# EAGLE design Stoicheia (EAGLE 9.6.2)
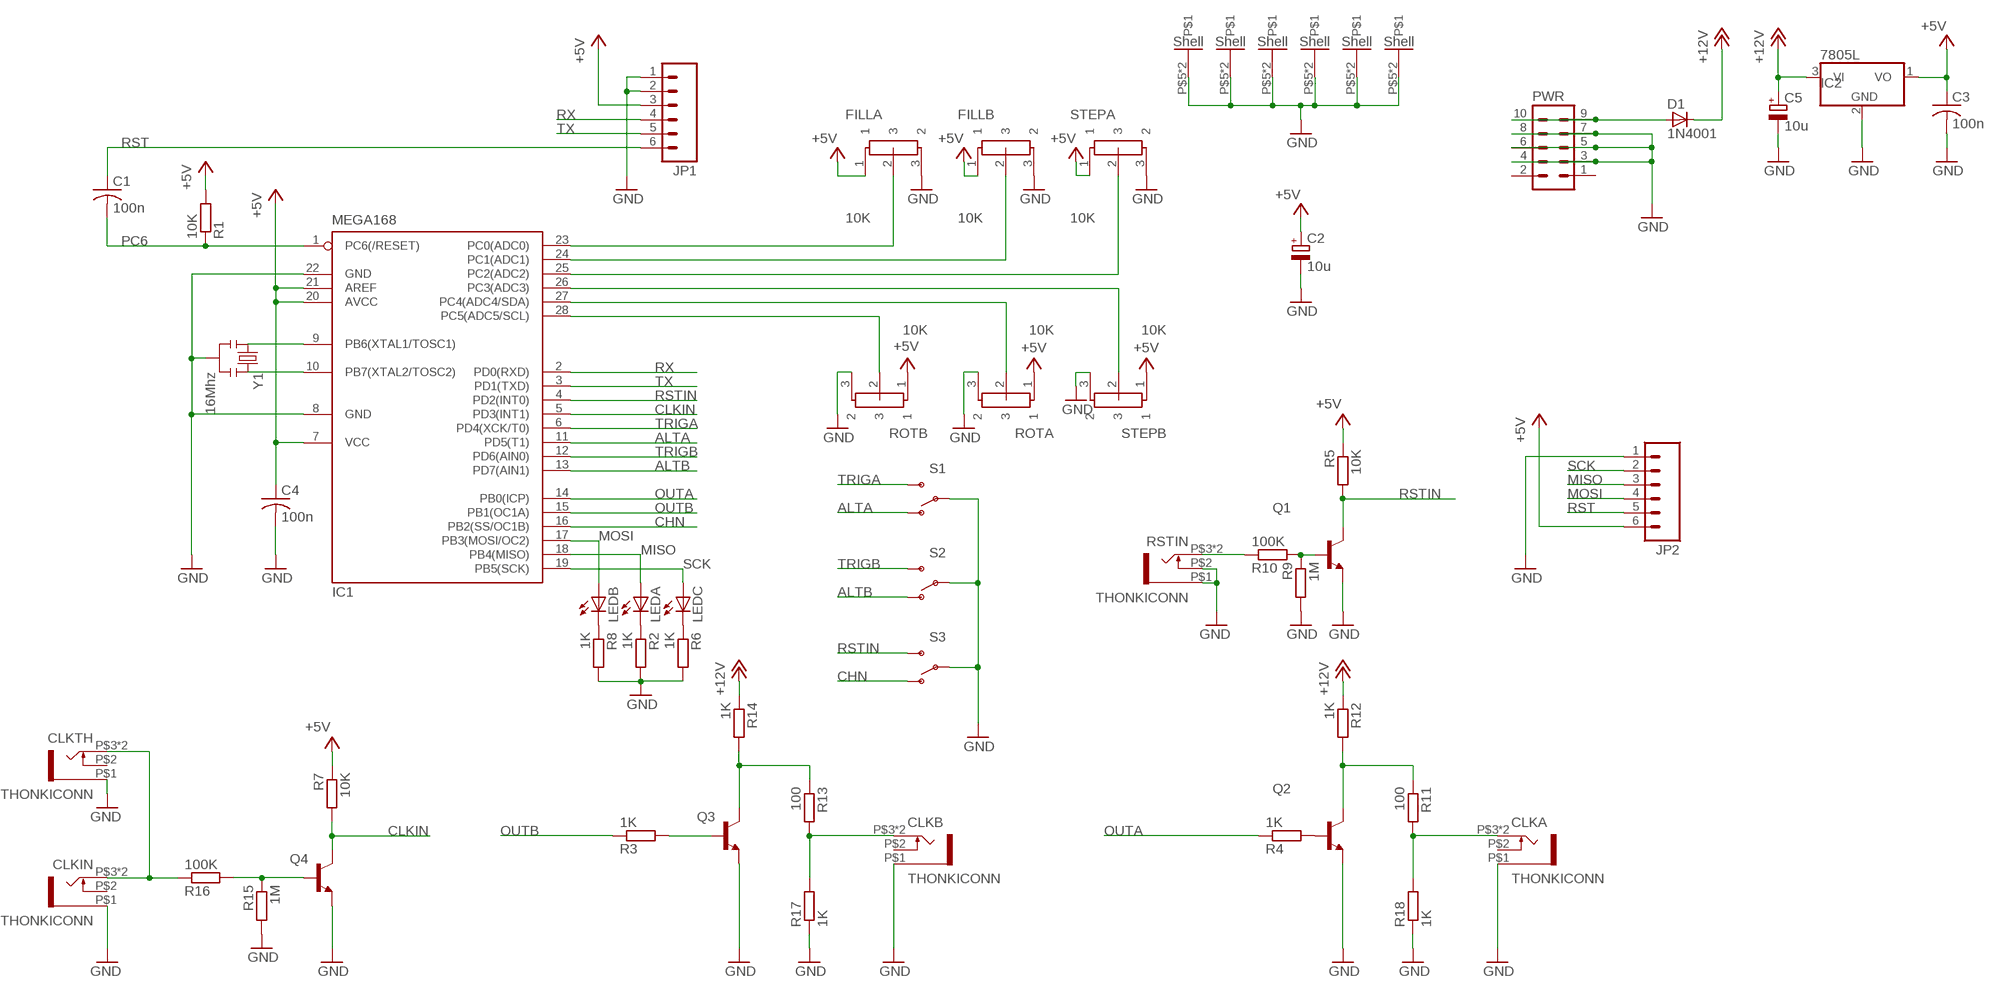
[diagram p0: schematic, sheet 1]

## Parts
C1  100n  C-US050-024X044  [C050-024X044]
C2  10u  CPOL-EUE5-6  [E5-6]
C3  100n  C-US050-024X044  [C050-024X044]
C4  100n  C-US050-024X044  [C050-024X044]
C5  10u  CPOL-EUE5-6  [E5-6]
CLKA  THONKICONN  [THONKICONN]
CLKB  THONKICONN  [THONKICONN]
CLKIN  THONKICONN  [THONKICONN]
CLKTH  THONKICONN  [THONKICONN]
D1  1N4001  DIODE1N4001  [DIODE-1N4001]
FILLA  10K  POT-ALPS_ALPS290024  [POT-ALPS-RK09L1140]
FILLB  10K  POT-ALPS_ALPS290024  [POT-ALPS-RK09L1140]
IC1  MEGA168  MEGA8-P  [DIL28-3]
IC2  7805L  [TO92]
JP1  M06SIP  [1X06]
JP2  M06SIP  [1X06]
LEDA  LED3MM  [LED3MM]
LEDB  LED3MM  [LED3MM]
LEDC  LED3MM  [LED3MM]
PWR  MA05-2  [MA05-2]
Q1  2N3904-NPN-TO92-EBC  [TO92-EBC]
Q2  2N3904-NPN-TO92-EBC  [TO92-EBC]
Q3  2N3904-NPN-TO92-EBC  [TO92-EBC]
Q4  2N3904-NPN-TO92-EBC  [TO92-EBC]
R1  10K  R-EU_0204/7  [0204/7]
R2  1K  R-EU_0204/7  [0204/7]
R3  1K  R-EU_0204/7  [0204/7]
R4  1K  R-EU_0204/7  [0204/7]
R5  10K  R-EU_0204/7  [0204/7]
R6  1K  R-EU_0204/7  [0204/7]
R7  10K  R-EU_0204/7  [0204/7]
R8  1K  R-EU_0204/7  [0204/7]
R9  1M  R-EU_0204/7  [0204/7]
R10  100K  R-EU_0204/7  [0204/7]
R11  100  R-EU_0204/7  [0204/7]
R12  1K  R-EU_0204/7  [0204/7]
R13  100  R-EU_0204/7  [0204/7]
R14  1K  R-EU_0204/7  [0204/7]
R15  1M  R-EU_0204/7  [0204/7]
R16  100K  R-EU_0204/7  [0204/7]
R17  1K  R-EU_0204/7  [0204/7]
R18  1K  R-EU_0204/7  [0204/7]
ROTA  10K  POT-ALPS_ALPS290024  [POT-ALPS-RK09L1140]
ROTB  10K  POT-ALPS_ALPS290024  [POT-ALPS-RK09L1140]
RSTIN  THONKICONN  [THONKICONN]
S1  SWITCH-SPST  [SWITCH-SPDT-SALECOM-T8014]
S2  SWITCH-SPST  [SWITCH-SPDT-SALECOM-T8014]
S3  SWITCH-SPST  [SWITCH-SPDT-SALECOM-T8014]
STEPA  10K  POT-ALPS_ALPS290024  [POT-ALPS-RK09L1140]
STEPB  10K  POT-ALPS_ALPS290024  [POT-ALPS-RK09L1140]
Y1  16Mhz  RESONATORPTH  [RESONATOR-PTH]

## Nets
+5V: C2.+ C3.1 C4.1 FILLA.1 FILLB.1 IC1.7(VCC) IC1.20(AVCC) IC1.21(AREF) IC2.1(VO) JP1.3 JP2.6 R1.2 R5.1 R7.1 ROTA.1 ROTB.1 STEPA.1 STEPB.1
+12V: C5.+ D1.C IC2.3(VI) R12.1 R14.1
ALTA: IC1.11(PD5(T1)) S1.1(O)
ALTB: IC1.13(PD7(AIN1)) S2.1(O)
CHN: IC1.16(PB2(SS/OC1B)) S3.1(O)
CLKIN: IC1.5(PD3(INT1)) Q4.C R7.2
FILFB: FILLB.2 IC1.24(PC1(ADC1))
GND: C2.- C3.2 C4.2 C5.- CLKA.P$1 CLKB.P$1 CLKIN.P$1 CLKTH.P$1 FILLA.3 FILLA.P$5 FILLA.P$6 FILLB.3 FILLB.P$5 FILLB.P$6 IC1.8(GND) IC1.22(GND) IC2.2(GND) JP1.1 JP1.2 JP2.1 PWR.3 PWR.4 PWR.5 PWR.6 PWR.7 PWR.8 Q1.E Q2.E Q3.E Q4.E R2.2 R6.2 R8.2 R9.2 R15.2 R17.1 R18.1 ROTA.3 ROTA.P$5 ROTA.P$6 ROTB.3 ROTB.P$5 ROTB.P$6 RSTIN.P$1 RSTIN.P$2 S1.2(P) S2.2(P) S3.2(P) STEPA.3 STEPA.P$5 STEPA.P$6 STEPB.3 STEPB.P$5 STEPB.P$6 Y1.2
MISO: IC1.18(PB4(MISO)) JP2.3 LEDA.A
MOSI: IC1.17(PB3(MOSI/OC2)) JP2.4 LEDB.A
N$1: FILLA.2 IC1.23(PC0(ADC0))
N$3: IC1.25(PC2(ADC2)) STEPA.2
N$4: IC1.26(PC3(ADC3)) STEPB.2
N$5: IC1.27(PC4(ADC4/SDA)) ROTA.2
N$6: IC1.28(PC5(ADC5/SCL)) ROTB.2
N$7: IC1.9(PB6(XTAL1/TOSC1)) Y1.1
N$8: IC1.10(PB7(XTAL2/TOSC2)) Y1.3
N$13: CLKB.P$3 CLKB.P$4 R13.2 R17.2
N$14: Q3.C R13.1 R14.2
N$17: Q4.B R15.1 R16.2
N$19: CLKIN.P$3 CLKIN.P$4 CLKTH.P$3 CLKTH.P$4 R16.1
N$20: R10.1 RSTIN.P$3 RSTIN.P$4
N$21: Q3.B R3.2
N$24: LEDB.K(C) R8.1
N$25: Q2.B R4.2
N$26: CLKA.P$3 CLKA.P$4 R11.2 R18.2
N$27: Q2.C R11.1 R12.2
N$28: LEDA.K(C) R2.1
N$30: LEDC.K(C) R6.1
N$32: Q1.B R9.1 R10.2
N$45: D1.A PWR.9 PWR.10
OUTA: IC1.14(PB0(ICP)) R4.1
OUTB: IC1.15(PB1(OC1A)) R3.1
PC6: C1.2 IC1.1(PC6(/RESET)) R1.1
RST: C1.1 JP1.6 JP2.5
RSTIN: IC1.4(PD2(INT0)) Q1.C R5.2 S3.3(S)
RX: IC1.2(PD0(RXD)) JP1.4
SCK: IC1.19(PB5(SCK)) JP2.2 LEDC.A
TRIGA: IC1.6(PD4(XCK/T0)) S1.3(S)
TRIGB: IC1.12(PD6(AIN0)) S2.3(S)
TX: IC1.3(PD1(TXD)) JP1.5
Unconnected: CLKA.P$2 CLKB.P$2 CLKIN.P$2 CLKTH.P$2 PWR.1 PWR.2

## Library data of the parts
C1 C3 C4 = rcl:C-US: CAPACITOR, American symbol
C2 C5 = rcl:CPOL-EU: POLARIZED CAPACITOR, European symbol
CLKA CLKB CLKIN CLKTH RSTIN = Rebel:THONKICONN
D1 = Rebel:DIODE: Diode These are standard reverse protection diodes and small signal diodes. SMA package can handle up to about 1A. SOD-323 can handle about 200mA. Watch the SOD-323 package when ordering, there are some mfgs out there that are 5-pin packages.
FILLA FILLB ROTA ROTB STEPA STEPB = Rebel:POT-ALPS_ALPS290024
IC1 = atmel:MEGA8-P: MICROCONTROLLER 8 Kbytes FLASH, 1 kbytes SRAM, 512 bytes EEPROM, USART, 4-channel 10 bit ADC, 2-channel 8 bit ADC Pin compatible with Atmega48, ATMega88, ATMega168 Source: avr.lbr; OC_FARNELL: unknown; OC_NEWARK: unknown
IC2 = linear:78*: Positive VOLTAGE REGULATOR Source: http://cache.national.com/ds/LM/LM78L05.pdf http://www.fairchildsemi.com/ds/LM/LM7805.pdf
JP1 JP2 = SparkFun:M06: Header 6 Standard 6-pin 0.1" header. Use with straight break away headers (SKU : PRT-00116), right angle break away headers (PRT-00553), swiss pins (PRT-00743), machine pins (PRT-00117), and female headers (PRT-00115). Molex polarized connector foot print use with SKU : PRT-08094 with associated crimp pins and housings. NOTES ON THE VARIANTS LOCK and LOCK_LONGPADS... This footprint was designed to help hold the alignment of a through-hole component (i.e. 6-pin header) while soldering it into place. You may notice that each hole has been shifted either up or down by 0.005 of an inch from it's more standard position (which is a perfectly straight line). This slight alteration caused the pins (the squares in the middle) to touch the edges of the holes. Because they are alternating, it causes a "brace" to hold the component in place. 0.005 has proven to be the perfect amount of "off-center" position when using our standard breakaway headers. Although looks a little odd when you look at the bare footprint, once you have a header in there, the alteration is very hard to notice. Also, if you push a header all the way into place, it is covered up entirely on the bottom side. This idea of altering the position of holes to aid alignment will be further integrated into the Sparkfun Library for other footprints. It can help hold any component with 3 or more connection pins.
LEDA LEDB LEDC = SparkFun:LED: LEDs Standard schematic elements and footprints for 5mm, 3mm, 1206, and 0603 sized LEDs. 5mm - Spark Fun Electronics SKU : COM-00529 (and others)
PWR = Rebel:MA05-2: PIN HEADER; OC_FARNELL: unknown; OC_NEWARK: unknown
Q1-Q4 = transistor-neu-to92:*-NPN-: NPN Transistror
R1-R18 = rcl:R-EU_: RESISTOR, European symbol
S1-S3 = Rebel:SWITCH-SPST: SPST Switch Simple slide switch. Spark Fun Electronics SKU : COM-00102
Y1 = SparkFun:RESONATOR: Resonator Small SMD resonator. This is the itty bitty 10/20MHz resonators with built in caps. CSTCE10M0G55 and CSTCE20M0V53. Footprint has been reviewed closely but hasn't been tested yet.

## Board
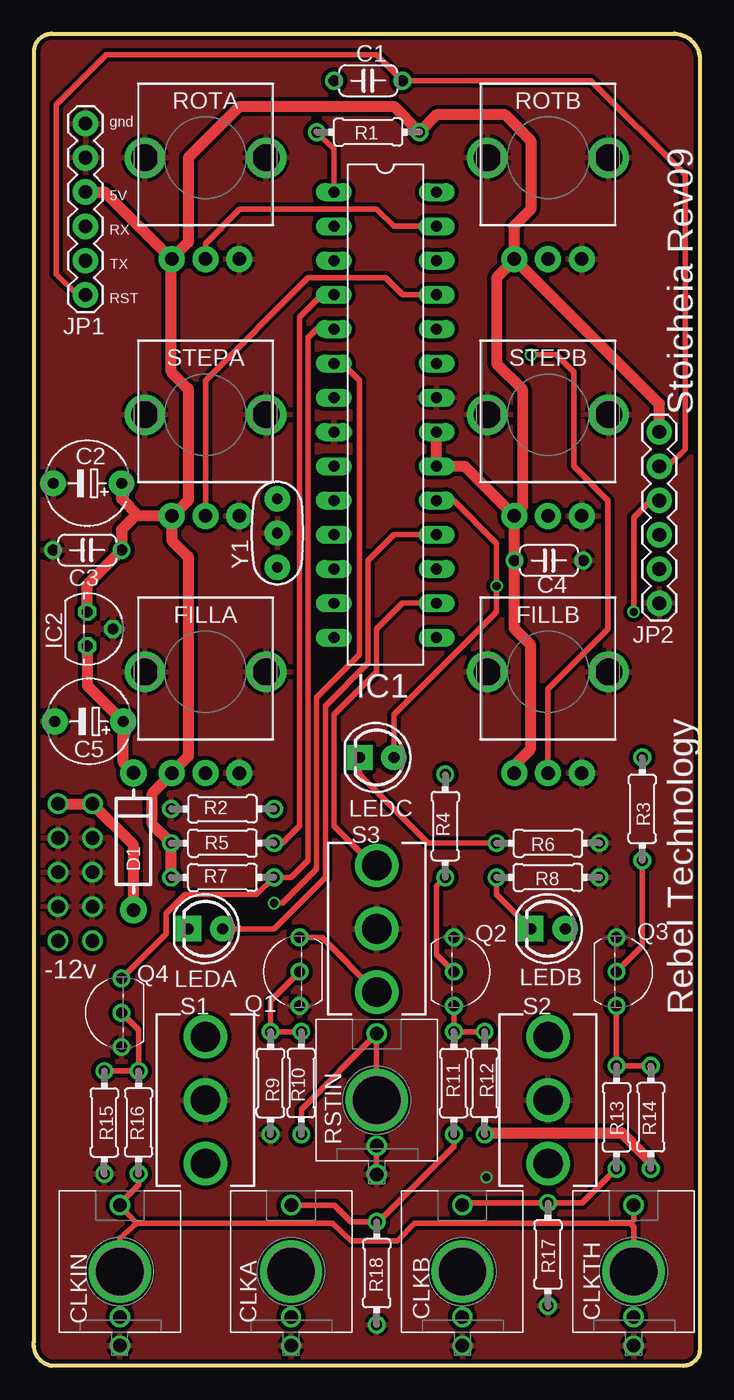
[diagram p1: board, top side]
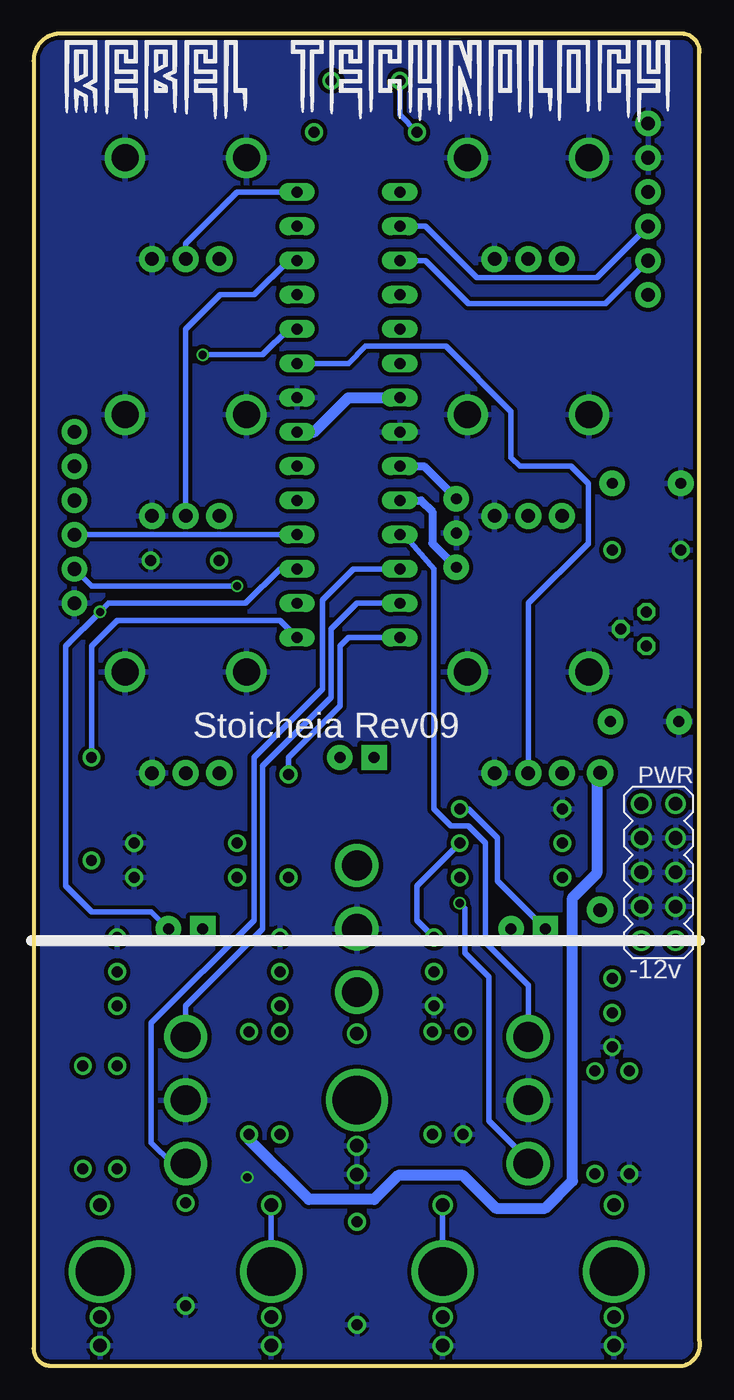
[diagram p2: board, bottom side, seen from below]

Size 49.4 x 98.73 mm. Coordinates in mm from the lower left corner, seen from the top.
Outline: 1.3,0 arc-90 0.03,1.91 0.03,97.34 arc-90 1.3,98.73 47.53,98.73 arc-90 49.4,96.71 49.4,1.27 arc-90 48.16,0 1.3,0
Copper layers (1*16): Top 0.035mm / dielectric 1.5mm / Bottom 0.035mm
Design rules "Fusion_eagle_rule_v1.1": minimum track width 6mil, minimum drill 12mil, track to track 6mil, track to pad 6mil, pad to pad 6mil, via to via 6mil, smd to smd 0mil, copper to edge 10mil, drill to drill 10mil, minimum pad ring 10mil, minimum via ring 6mil, stop-mask expansion 2mil, vias tented up to drill 100mil, thermal gap 10mil

### Footprints (pad centres in the part's own frame; a part is rotated, then mirrored left to right if it is on the bottom)
C050-024X044 = drill 0.813: 1 -2.54,0; 2 2.54,0
E5-6 = drill 0.813 pad 1.905: + -2.54,0; - 2.54,0
THONKICONN = drill 1: P$1 0,-5.5; P$2 0,-3.38; P$3 0,4.92 | drill 3.6: P$4 0,0
DIODE-1N4001 = drill 1 pad 1.981: A -5.08,0; C 5.08,0
POT-ALPS-RK09L1140 = drill 1 pad 1.93: 1 -2.5,-7.5; 2 0,-7.5; 3 2.5,-7.5 | drill 2: P$5 -4.5,0; P$6 4.5,0
DIL28-3 = drill 0.813 long: 1 -16.51,-3.81; 2 -13.97,-3.81; 3 -11.43,-3.81; 4 -8.89,-3.81; 5 -6.35,-3.81; 6 -3.81,-3.81; 7 -1.27,-3.81; 8 1.27,-3.81; 9 3.81,-3.81; 10 6.35,-3.81; 11 8.89,-3.81; 12 11.43,-3.81; 13 13.97,-3.81; 14 16.51,-3.81; 15 16.51,3.81; 16 13.97,3.81; 17 11.43,3.81; 18 8.89,3.81; 19 6.35,3.81; 20 3.81,3.81; 21 1.27,3.81; 22 -1.27,3.81; 23 -3.81,3.81; 24 -6.35,3.81; 25 -8.89,3.81; 26 -11.43,3.81; 27 -13.97,3.81; 28 -16.51,3.81
TO92 = drill 0.813 octagon: 1 -1.27,0; 2 0,1.905; 3 1.27,0
1X06 = drill 1.016 pad 1.88: 1 0,0; 2 2.54,0; 3 5.08,0; 4 7.62,0; 5 10.16,0; 6 12.7,0
LED3MM = drill 0.813 pad 1.88: A -1.27,0 | drill 0.813 pad 1.88 square: K 1.27,0
MA05-2 = drill 1.016: 1 -5.08,-1.27; 2 -5.08,1.27; 3 -2.54,-1.27; 4 -2.54,1.27; 5 0,-1.27; 6 0,1.27; 7 2.54,-1.27; 8 2.54,1.27; 9 5.08,-1.27; 10 5.08,1.27
TO92-EBC = drill 0.813: B 0,-1.27; C 2.54,-1.27; E -2.54,-1.27
0204/7 = drill 0.813: 1 -3.81,0; 2 3.81,0
SWITCH-SPDT-SALECOM-T8014 = drill 2.2: 1 0,4.699; 2 0,0; 3 0,-4.699
RESONATOR-PTH = drill 0.8 pad 1.88: 1 -2.54,0; 2 0,0; 3 2.54,0

### Placement (x,y rotation side)
C1  24.8,95.25 180 top
C2  3.97,65.41 180 top
C3  3.97,60.45 180 top
C4  38.19,59.69 0 top
C5  4.1,47.75 180 top
CLKA  19.08,6.98 0 top
CLKB  31.78,6.98 0 top
CLKIN  6.38,6.98 0 top
CLKTH  44.48,6.98 0 top
D1  7.4,38.86 90 top
FILLA  12.73,51.43 0 top
FILLB  38.13,51.43 0 top
IC1  26.07,70.48 270 top
IC2  3.97,54.61 270 top
JP1  3.84,92.08 270 top
JP2  46.39,56.52 90 top
LEDA  12.73,32.38 180 top
LEDB  38.13,32.38 180 top
LEDC  25.43,45.09 180 top
PWR  3.08,36.58 90 bottom
Q1  18.45,29.21 90 top
Q2  32.42,29.21 270 top
Q3  44.48,29.21 270 top
Q4  5.24,26.16 90 top
R1  24.8,91.44 0 top
R2  14,41.27 180 top
R3  45.12,41.27 270 top
R4  30.51,40 270 top
R5  14,38.73 0 top
R6  38.13,38.73 0 top
R7  14,36.2 0 top
R8  38.13,36.2 0 top
R9  17.56,20.96 270 top
R10  19.84,20.96 90 top
R11  31.15,20.96 270 top
R12  33.43,20.96 90 top
R13  43.21,18.42 270 top
R14  45.75,18.42 90 top
R15  5.24,18.03 270 top
R16  7.78,18.03 90 top
R17  38.13,8.26 90 top
R18  25.43,6.86 90 top
ROTA  12.73,89.54 0 top
ROTB  38.13,89.54 0 top
RSTIN  25.43,19.69 0 top
S1  12.73,19.69 0 top
S2  38.13,19.69 0 top
S3  25.43,32.38 0 top
STEPA  12.73,70.48 0 top
STEPB  38.13,70.48 0 top
Y1  18.07,61.72 270 top

### Tracks (layer width: path | path; a pad name or v marks a point on that pad's centre or on a via)
+5V
  Top 0.813: ROTB.1 35.59,82.08 35.59,84.45 36.86,85.73 36.86,90.81 34.96,92.71 29.88,92.71 R1.2 26.7,93.34 15.27,93.34 11.46,89.54 11.46,83.27 ROTA.1 | FILLB.1 35.63,44.49 36.86,45.72 36.86,53.42 35.63,54.65 35.63,60.3 C4.1 35.65,62.96 STEPB.1 | IC1.21 IC1.20 31.94,66.68 STEPB.1 | JP1.3 5.27,87 ROTA.1 | STEPA.1 10.31,62.98 11.46,64.14 11.46,72.39 10.19,73.66 10.19,82 ROTA.1 | JP2.6 46.39,71.28 ROTB.1 | ROTB.1 35.63,81.95 34.32,80.65 34.32,74.3 36.23,72.39 36.23,63.58 STEPB.1 | R7.1 R5.1 8.79,40.13 8.79,42.42 10.23,43.85 FILLA.1 11.46,45.16 11.46,59.94 10.23,61.17 STEPA.1 | C2.+ 6.51,64.26 7.79,62.98 STEPA.1 | STEPA.1 7.52,62.98 6.51,61.98 C3.1 3.97,57.91 IC2.1
  Bottom 0.813: IC1.21 28.61,69.22 26.07,71.76 IC1.7
+12V
  Top 0.813: R12.1 33.56,17.27 43.59,17.27 45.75,15.11 R14.1 | D1.C 6.64,44.7 C5.+ 3.97,50.42 IC2.3
  Bottom 0.813: D1.C 7.65,43.69 7.65,36.48 9.45,34.68 9.45,13.69 11.46,11.68 15.14,11.68 17.56,14.1 22.38,14.1 24.16,12.32 28.99,12.32 33.43,16.76 R12.1
ALTA
  Bottom 0.406: IC1.11 21.94,61.59 19.72,59.05 19.72,41.27 18.45,40 17.18,40 15.91,38.73 15.91,31.37 12.73,28.19 S1.1
ALTB
  Bottom 0.406: IC1.13 25.43,56.52 27.34,54.61 27.34,49.53 32.42,44.45 32.42,32.38 38.13,26.67 S2.1
CHN
  Top 0.406: IC1.16 27.34,56.52 25.43,54.61 25.43,51.43 22.26,48.26 22.26,40 25.18,37.08 S3.1
CLKIN
  Top 0.406: IC1.5 20.99,76.84 20.35,76.2 20.35,37.46 19.08,36.2 R7.2 16.54,34.92 11.21,34.92 9.81,33.53 9.81,32 Q4.C
FILFB  (via drill 0.6)
  Top 0.406: v36.86,74.93 38.77,74.93 40.04,73.66 40.04,66.68 42.58,64.14 42.58,54.61 38.13,50.16 FILLB.2
  Bottom 0.406: v36.86,74.93 32.42,74.93 30.51,76.84 IC1.24
GND  (via drill 0.6)
  Top 0.406: RSTIN.P$1 RSTIN.P$2
  other vias: 33.56,13.97
  pour Bottom (isolate 0.305): 50.83,-1.91 0.03,-1.91 0.03,100.64 50.83,100.64
  pour Top (isolate 0.305): 50.83,-1.91 0.03,-1.91 0.03,100.97 50.83,100.97
MISO
  Top 0.406: LEDA.A 17.81,32.38 21.62,36.2 21.62,48.89 24.8,52.07 24.8,59.69 26.7,61.59 IC1.18
  Bottom 0.406: IC1.18 JP2.3
MOSI  (via drill 0.6)
  Top 0.406: v44.48,55.88 44.48,62.86 45.75,64.14 JP2.4
  Bottom 0.406: LEDB.A 40.67,33.66 45.12,33.66 47.02,35.56 47.02,53.34 v44.48,55.88 43.85,56.52 33.69,56.52 31.15,59.05 IC1.17
N$1
  Bottom 0.406: IC1.23 26.07,74.3 24.8,75.57 18.83,75.57 14,70.74 14,67.31 13.37,66.68 9.56,66.68 8.29,65.41 8.29,60.96 12.73,56.52 FILLA.2
N$3
  Top 0.406: IC1.25 27.34,79.38 26.07,80.65 20.35,80.65 12.73,73.03 STEPA.2
N$4
  Bottom 0.406: STEPB.2 38.13,76.84 35.59,79.38 33.05,79.38 30.51,81.92 IC1.26
N$5
  Top 0.406: IC1.27 26.7,84.45 25.43,85.73 15.27,85.73 12.73,83.19 ROTA.2
N$6
  Bottom 0.406: ROTB.2 38.13,83.19 34.32,87 IC1.28
N$7
  Bottom 0.61: IC1.9 20.48,66.68 Y1.1
N$8
  Bottom 0.61: IC1.10 20.67,64.14 19.84,63.31 19.84,60.96 Y1.3
N$13
  Top 0.406: R13.2 40.67,12.06 R17.2 31.94,12.06 CLKB.P$3
  Bottom 0.406: CLKB.P$3 CLKB.P$4
N$14
  Top 0.406: Q3.C R13.1 R14.2
N$17
  Top 0.406: R15.1 R16.2 7.78,24.89 Q4.B
N$19
  Top 0.406: 44.23,10.54 28.23,10.54 26.96,9.27 23.54,9.27 22.14,10.54 7.62,10.54 | 7.62,10.54 CLKIN.P$3 6.33,11.95 7.78,13.4 R16.1 | CLKIN.P$4 6.38,9.43 7.62,10.54 | CLKTH.P$4 44.48,10.29 44.23,10.54 | CLKTH.P$3 44.48,10.79 44.23,10.54
N$20
  Top 0.406: R10.1 19.84,19.02 RSTIN.P$3 RSTIN.P$4
N$21
  Top 0.406: R3.2 45.12,31.12 Q3.B
N$24
  Top 0.406: R8.1 34.32,34.92 LEDB.K
N$25
  Top 0.406: Q2.B 29.88,30.48 29.88,35.56 R4.2
N$26
  Top 0.406: R11.2 31.15,16.26 25.56,10.67 R18.2 23.53,10.67 22.29,11.9 CLKA.P$3
  Bottom 0.406: CLKA.P$4 CLKA.P$3
N$27
  Top 0.406: Q2.C R11.1 R12.2
N$28
  Bottom 0.406: LEDA.K 15.02,35.94 15.02,39.12 17.18,41.27 R2.1
N$30
  Top 0.406: LEDC.K 24.16,43.81 29.24,38.73 R6.1
N$32
  Top 0.406: R10.2 R9.1 17.56,27.05 Q1.B
N$45
  Top 0.813: PWR.9 PWR.10 7.4,38.61 D1.A
OUTA
  Bottom 0.406: IC1.14 26.07,53.98 26.7,53.34 26.7,48.89 30.51,45.09 R4.1
OUTB
  Bottom 0.406: R3.1 45.12,53.34 43.21,55.24 31.15,55.24 IC1.15
PC6
  Top 0.406: IC1.1 22.26,90.17 R1.1
  Bottom 0.406: C1.2 22.26,92.71 R1.1
RST
  Top 0.406: JP1.6 3.21,79.38 1.68,80.9 1.68,93.47 5.37,97.16 25.43,97.16 C1.1 41.31,95.25 48.29,88.27 48.29,67.95 47.02,66.68 JP2.5
RSTIN
  Top 0.406: IC1.4 21.37,79.38 19.72,77.72 19.72,40 18.45,38.73 R5.2 | S3.3 21.37,31.75 Q1.C
  Bottom 0.406: R5.2 20.99,35.56 20.99,33.02 Q1.C
RX
  Bottom 0.406: JP1.4 7.65,80.65 16.54,80.65 20.35,84.45 IC1.2
SCK  (via drill 0.6)
  Top 0.406: IC1.19 31.15,64.14 34.32,60.96 v34.32,57.78 34.32,55.88 26.7,48.26 LEDC.A
  Bottom 0.406: v34.32,57.78 45.12,57.78 JP2.2
TRIGA  (via drill 0.6)
  Top 0.406: IC1.6 22.89,74.3 24.16,73.03 24.16,52.7 20.99,49.53 20.99,36.83 18.45,34.29 v17.81,34.29
  Bottom 0.406: v17.81,34.29 17.43,33.91 17.43,30.61 15.65,28.83 15.65,18.16 12.73,15.24 S1.3
TRIGB
  Bottom 0.406: S2.3 39.15,14.99 40.67,16.51 40.67,25.4 33.05,33.02 33.05,45.09 27.97,50.16 27.97,56.77 25.69,59.05 IC1.12
TX
  Bottom 0.406: IC1.3 20.35,81.92 17.18,78.74 7.02,78.74 JP1.5

### Text on the board
tPlace: gnd | 5V | RX | TX | RST | Stoicheia Rev09 | -12v | Rebel Technology
bPlace: Stoicheia Rev09 | -12v
tNames: Y1